# EAGLE design rpi2_lcd (EAGLE 7.6.0)
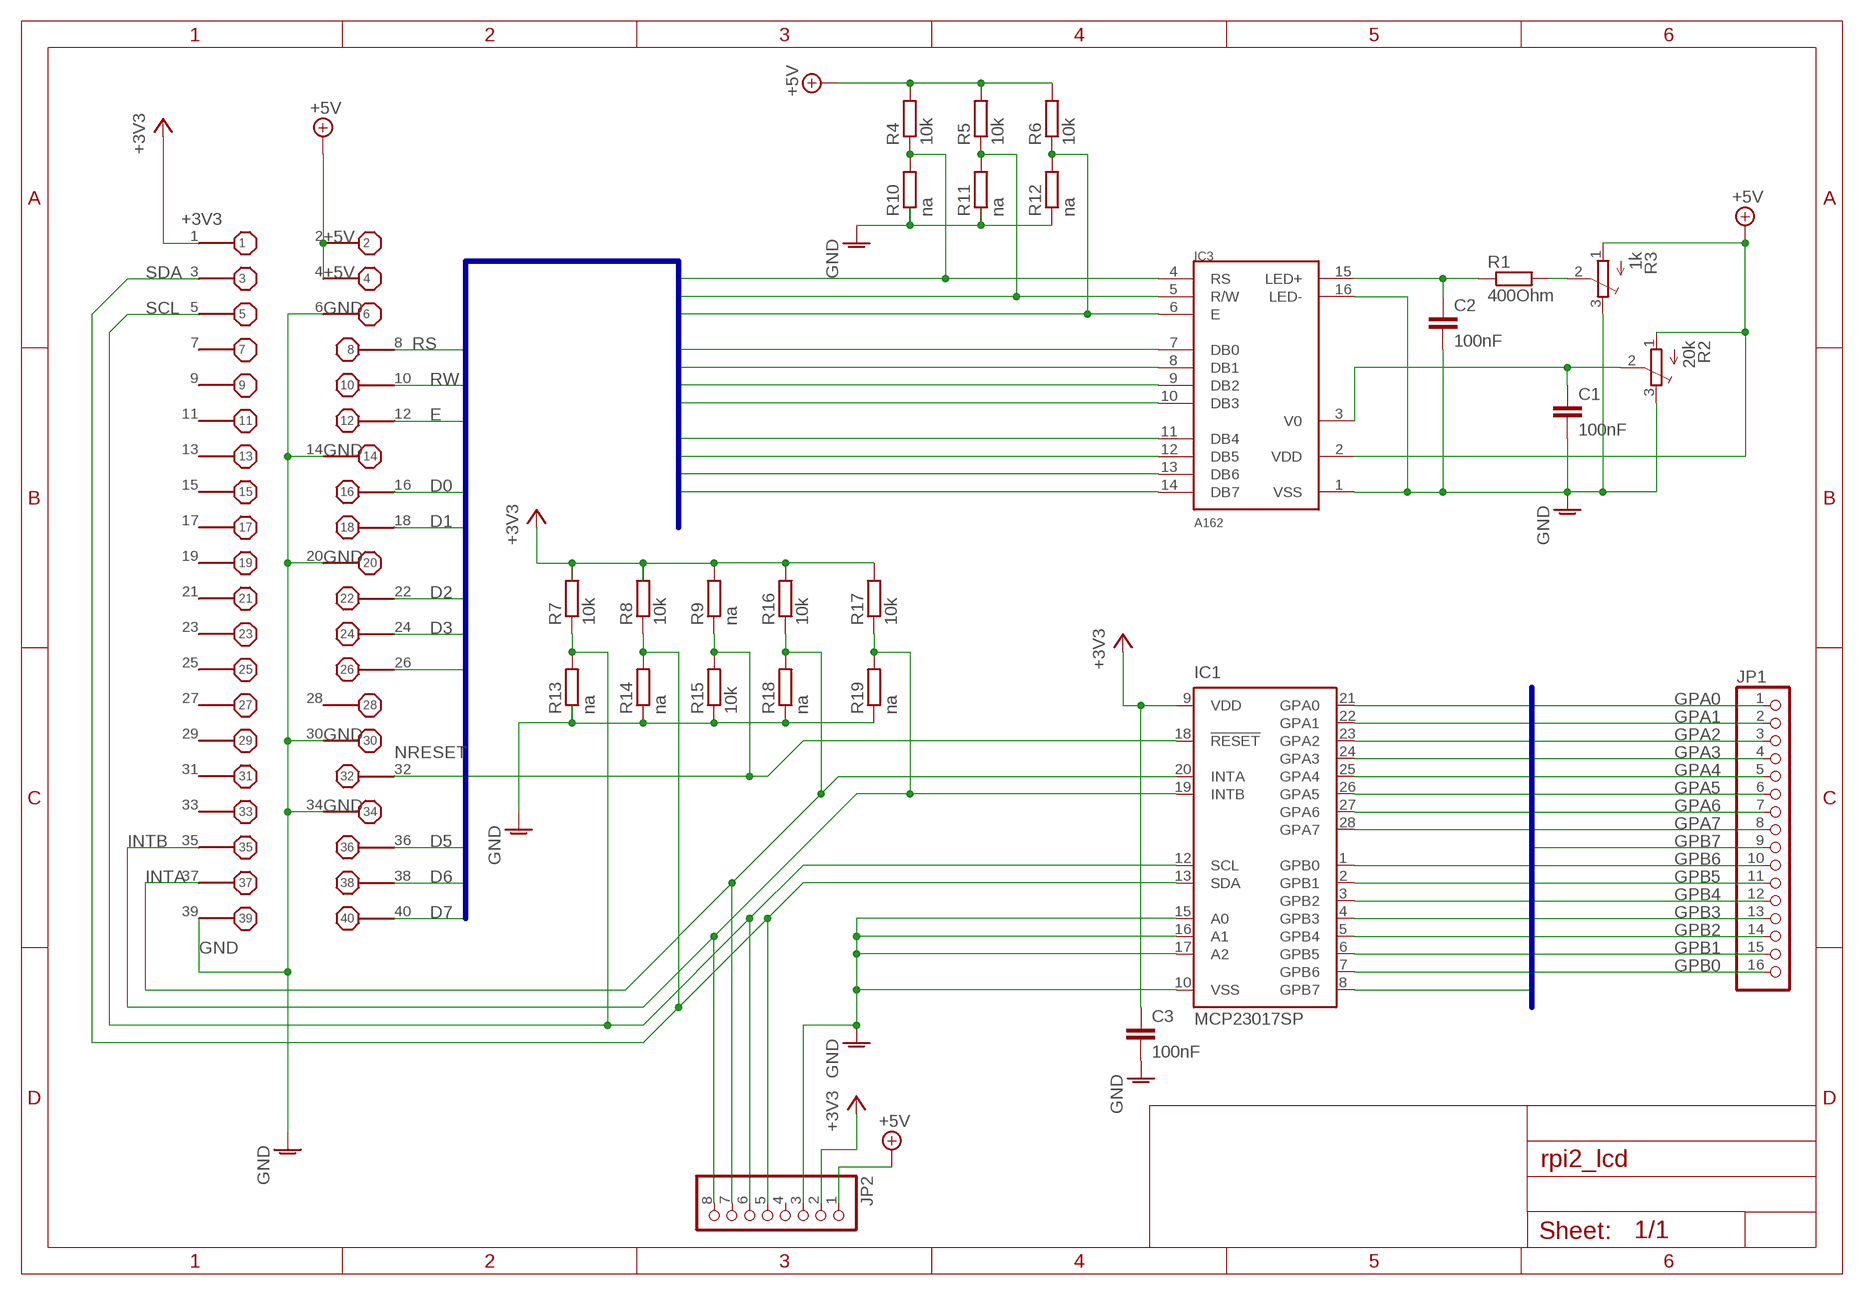
[diagram p0: schematic, sheet 1]

## Parts
C1  100nF  C-EUC0603  [C0603]
C2  100nF  C-EUC0603  [C0603]
C3  100nF  C-EUC0603  [C0603]
IC1  MCP23017SP  [DIL28-3]
IC3  A162  [A162]
JP1  PINHD-1X16  [1X16]
JP2  PINHD-1X8  [1X08]
R1  400Ohm  R-EU_R0603  [R0603]
R2  20k  TRIM_EU-SM-42/43W  [SM-42/43W]
R3  1k  TRIM_EU-SM-42/43W  [SM-42/43W]
R4  10k  R-EU_R0603  [R0603]
R5  10k  R-EU_R0603  [R0603]
R6  10k  R-EU_R0603  [R0603]
R7  10k  R-EU_R0603  [R0603]
R8  10k  R-EU_R0603  [R0603]
R9  na  R-EU_R0603  [R0603]
R10  na  R-EU_R0603  [R0603]
R11  na  R-EU_R0603  [R0603]
R12  na  R-EU_R0603  [R0603]
R13  na  R-EU_R0603  [R0603]
R14  na  R-EU_R0603  [R0603]
R15  10k  R-EU_R0603  [R0603]
R16  10k  R-EU_R0603  [R0603]
R17  10k  R-EU_R0603  [R0603]
R18  na  R-EU_R0603  [R0603]
R19  na  R-EU_R0603  [R0603]
X1  B+_GPIO  [B+_GPIO]

## Nets
+3V3: C3.1 IC1.9(VDD) JP2.2 R7.2 R8.2 R9.2 R16.2 R17.2 X1.1
+5V: IC3.2(VDD) JP2.1 R2.1(A) R3.1(A) R4.2 R5.2 R6.2 X1.2 X1.4
D0: IC3.7(DB0) X1.16
D1: IC3.8(DB1) X1.18
D2: IC3.9(DB2) X1.22
D3: IC3.10(DB3) X1.24
D4: IC3.11(DB4) X1.26
D5: IC3.12(DB5) X1.36
D6: IC3.13(DB6) X1.38
D7: IC3.14(DB7) X1.40
E: IC3.6(E) R6.1 R12.2 X1.12
GND: C1.2 C2.2 C3.2 IC1.10(VSS) IC1.15(A0) IC1.16(A1) IC1.17(A2) IC3.1(VSS) IC3.16(LED-) JP2.3 R2.3(E) R3.3(E) R10.1 R11.1 R12.1 R13.1 R14.1 R15.1 R18.1 R19.1 X1.6 X1.14 X1.20 X1.30 X1.34 X1.39
GPA0: IC1.21(GPA0) JP1.1
GPA1: IC1.22(GPA1) JP1.2
GPA2: IC1.23(GPA2) JP1.3
GPA3: IC1.24(GPA3) JP1.4
GPA4: IC1.25(GPA4) JP1.5
GPA5: IC1.26(GPA5) JP1.6
GPA6: IC1.27(GPA6) JP1.7
GPA7: IC1.28(GPA7) JP1.8
GPB0: IC1.1(GPB0) JP1.16
GPB1: IC1.2(GPB1) JP1.15
GPB2: IC1.3(GPB2) JP1.14
GPB3: IC1.4(GPB3) JP1.13
GPB4: IC1.5(GPB4) JP1.12
GPB5: IC1.6(GPB5) JP1.11
GPB6: IC1.7(GPB6) JP1.10
GPB7: IC1.8(GPB7) JP1.9
INTA: IC1.20(INTA) JP2.7 R16.1 R18.2 X1.37
INTB: IC1.19(INTB) JP2.8 R17.1 R19.2 X1.35
N$1: C2.1 IC3.15(LED+) R1.1
N$2: C1.1 IC3.3(V0) R2.2(S)
N$8: R1.2 R3.2(S)
NRESET: IC1.18(!RESET) R9.1 R15.2 X1.32
RS: IC3.4(RS) R4.1 R10.2 X1.8
RW: IC3.5(R/W) R5.1 R11.2 X1.10
SCL: IC1.12(SCL) JP2.6 R7.1 R13.2 X1.5
SDA: IC1.13(SDA) JP2.5 R8.1 R14.2 X1.3
Unconnected: JP2.4 X1.7 X1.9 X1.11 X1.13 X1.15 X1.17 X1.19 X1.21 X1.23 X1.25 X1.27 X1.28 X1.29 X1.31 X1.33

## Buses
GPA[0..7],GPB[0..7]
RS,RW,E,D[0..7]

## Library data of the parts
C1-C3 = rcl:C-EU: CAPACITOR, European symbol
IC1 = microchip:MCP23017: http://ww1.microchip.com/downloads/en/DeviceDoc/21952a.pdf Source: http://ww1.microchip.com/downloads/en/DeviceDoc/21952a.pdf; MF: MICROCHIP; MPN: MCP23017-E/SP; OC_FARNELL: 1332088; OC_NEWARK: 31K2959
IC3 = display:A162
JP1 = pinhead:PINHD-1X16: PIN HEADER
JP2 = pinhead:PINHD-1X8: PIN HEADER
R1 R4-R19 = rcl:R-EU_: RESISTOR, European symbol
R2 R3 = pot:TRIM_EU-: POTENTIOMETER
X1 = raspberry:B+_GPIO

## Board
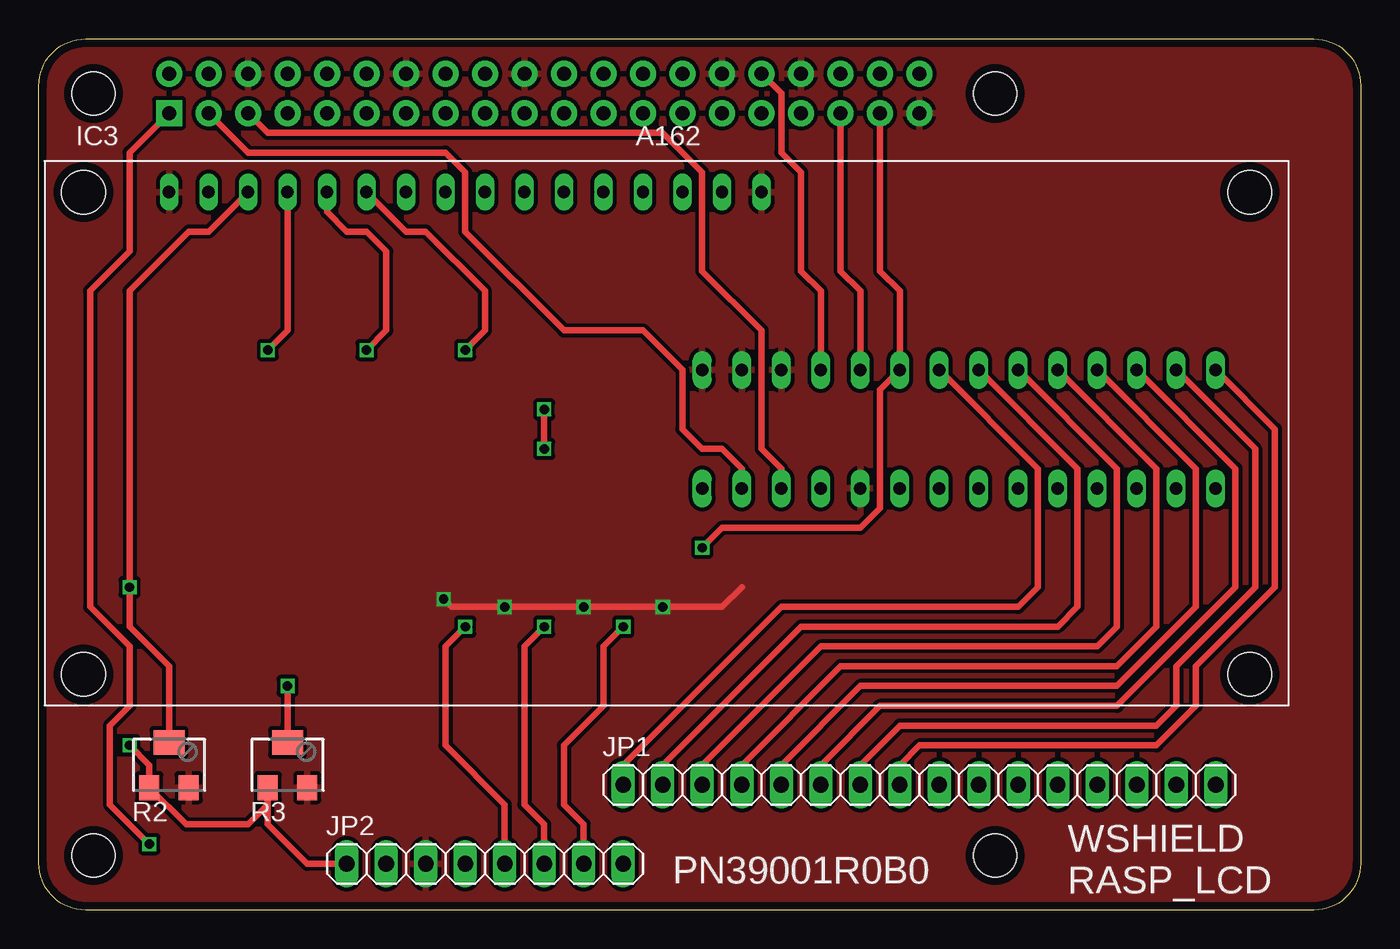
[diagram p1: board, top side]
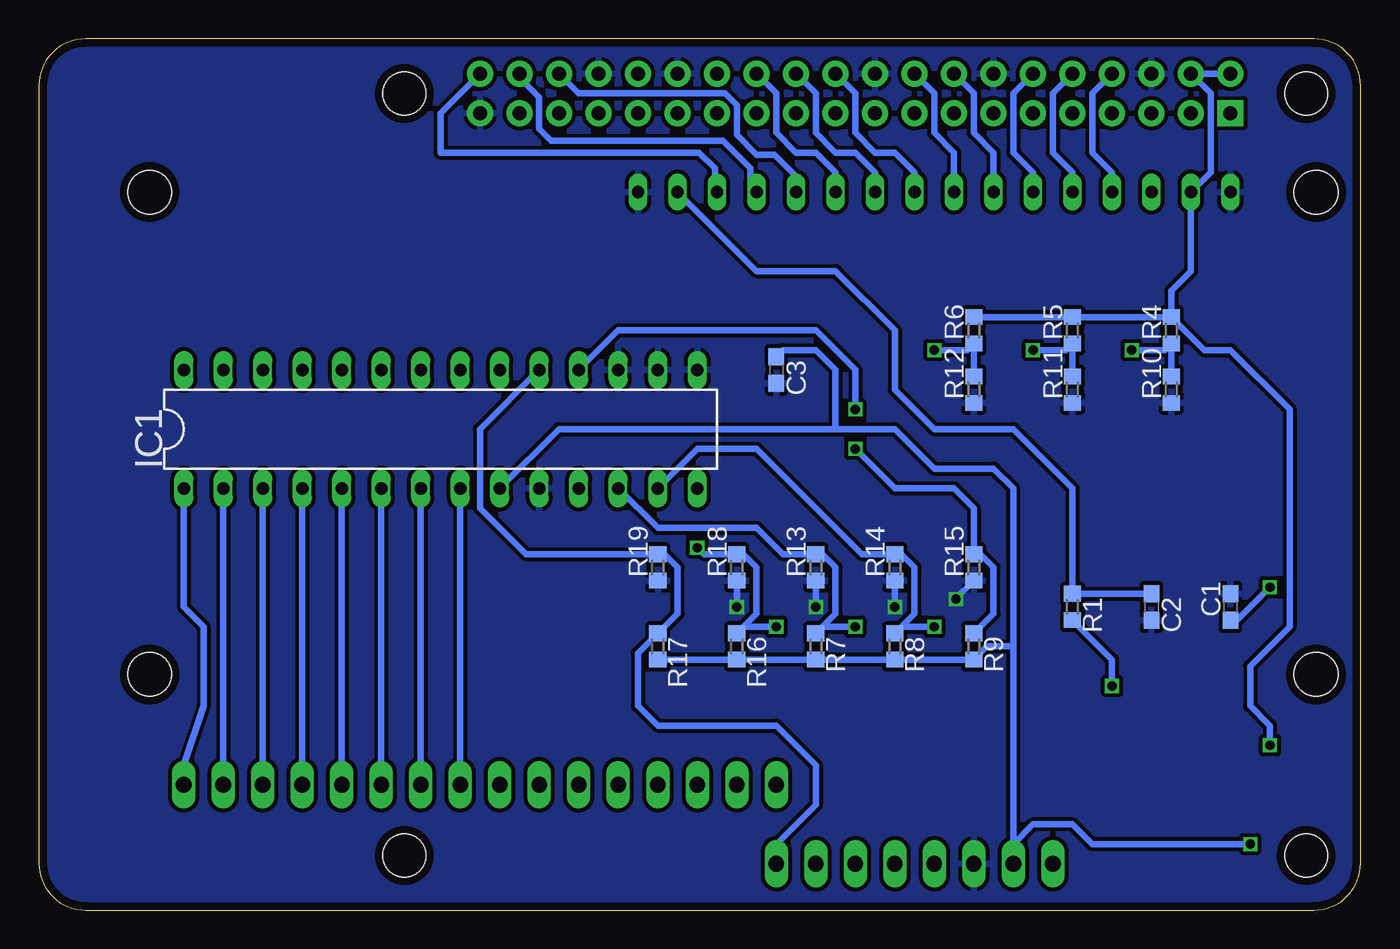
[diagram p2: board, bottom side, seen from below]

Size 85 x 56 mm. Coordinates in mm from the lower left corner, seen from the top.
Outline: 0,53 arc-90 3,56 82,56 arc-90 85,53 85,3 arc-90 82,0 3,0 arc-90 0,3 0,53
Copper layers (1*16): Top 0.035mm / dielectric 1.6mm / Bottom 0.035mm
Design rules "Elecrow_2-layer_PCB_eagle_rule": minimum track width 6mil, minimum drill 12mil, track to track 6mil, track to pad 6mil, pad to pad 6mil, via to via 8mil, smd to smd 0mil, copper to edge 20mil, drill to drill 10mil, minimum pad ring 6mil, minimum via ring 6mil, stop-mask expansion 0mil, vias tented up to drill 100mil, thermal gap 10mil
Holes 2.75 mm at 3.5,52.5 3.5,3.5 61.5,52.5 61.5,3.5

### Footprints (pad centres in the part's own frame; a part is rotated, then mirrored left to right if it is on the bottom)
C0603 = smd 1.1 x 1: 1 -0.85,0; 2 0.85,0
DIL28-3 = drill 0.813 long: 1 -16.51,-3.81; 2 -13.97,-3.81; 3 -11.43,-3.81; 4 -8.89,-3.81; 5 -6.35,-3.81; 6 -3.81,-3.81; 7 -1.27,-3.81; 8 1.27,-3.81; 9 3.81,-3.81; 10 6.35,-3.81; 11 8.89,-3.81; 12 11.43,-3.81; 13 13.97,-3.81; 14 16.51,-3.81; 15 16.51,3.81; 16 13.97,3.81; 17 11.43,3.81; 18 8.89,3.81; 19 6.35,3.81; 20 3.81,3.81; 21 1.27,3.81; 22 -1.27,3.81; 23 -3.81,3.81; 24 -6.35,3.81; 25 -8.89,3.81; 26 -11.43,3.81; 27 -13.97,3.81; 28 -16.51,3.81
A162 = drill 0.8 long: 1 0,0; 2 2.54,0; 3 5.08,0; 4 7.62,0; 5 10.16,0; 6 12.7,0; 7 15.24,0; 8 17.78,0; 9 20.32,0; 10 22.86,0; 11 25.4,0; 12 27.94,0; 13 30.48,0; 14 33.02,0; 15 35.56,0; 16 38.1,0 | hole 2.8: -5.5,0; -5.5,-31; 69.5,0; 69.5,-31
1X16 = drill 1.016 long: 1 -19.05,0; 2 -16.51,0; 3 -13.97,0; 4 -11.43,0; 5 -8.89,0; 6 -6.35,0; 7 -3.81,0; 8 -1.27,0; 9 1.27,0; 10 3.81,0; 11 6.35,0; 12 8.89,0; 13 11.43,0; 14 13.97,0; 15 16.51,0; 16 19.05,0
1X08 = drill 1.016 long: 1 -8.89,0; 2 -6.35,0; 3 -3.81,0; 4 -1.27,0; 5 1.27,0; 6 3.81,0; 7 6.35,0; 8 8.89,0
R0603 = smd 1 x 1.1: 1 -0.85,0; 2 0.85,0
SM-42/43W = smd 1.3 x 1.6: 1 -1.27,-1.45; 3 1.27,-1.45 | smd 2 x 1.6: 2 0,1.45
B+_GPIO = drill 0.9 pad 1.676 square: 1 -24.13,-1.27 | drill 0.9 pad 1.676: 2 -24.13,1.27; 3 -21.59,-1.27; 4 -21.59,1.27; 5 -19.05,-1.27; 6 -19.05,1.27; 7 -16.51,-1.27; 8 -16.51,1.27; 9 -13.97,-1.27; 10 -13.97,1.27; 11 -11.43,-1.27; 12 -11.43,1.27; 13 -8.89,-1.27; 14 -8.89,1.27; 15 -6.35,-1.27; 16 -6.35,1.27; 17 -3.81,-1.27; 18 -3.81,1.27; 19 -1.27,-1.27; 20 -1.27,1.27; 21 1.27,-1.27; 22 1.27,1.27; 23 3.81,-1.27; 24 3.81,1.27; 25 6.35,-1.27; 26 6.35,1.27; 27 8.89,-1.27; 28 8.89,1.27; 29 11.43,-1.27; 30 11.43,1.27; 31 13.97,-1.27; 32 13.97,1.27; 33 16.51,-1.27; 34 16.51,1.27; 35 19.05,-1.27; 36 19.05,1.27; 37 21.59,-1.27; 38 21.59,1.27; 39 24.13,-1.27; 40 24.13,1.27

### Placement (x,y rotation side)
C1  8.37,19.48 90 bottom
C2  13.45,19.48 270 bottom
C3  37.58,34.72 270 bottom
IC1  59.17,30.91 0 bottom
IC3  8.37,46.15 0 top
JP1  56.63,8.05 0 top
JP2  28.69,2.97 0 top
R1  18.53,19.48 270 bottom
R2  8.37,9.32 0 top
R3  15.99,9.32 0 top
R4  12.18,37.26 90 bottom
R5  18.53,37.26 90 bottom
R6  24.88,37.26 90 bottom
R7  35.04,16.94 270 bottom
R8  29.96,16.94 270 bottom
R9  24.88,16.94 270 bottom
R10  12.18,33.45 90 bottom
R11  18.53,33.45 90 bottom
R12  24.88,33.45 90 bottom
R13  35.04,22.02 90 bottom
R14  29.96,22.02 90 bottom
R15  24.88,22.02 90 bottom
R16  40.12,16.94 270 bottom
R17  45.2,16.94 270 bottom
R18  40.12,22.02 90 bottom
R19  45.2,22.02 90 bottom
X1  32.5,52.5 0 top

### Tracks (layer width: path | path; a pad name or v marks a point on that pad's centre or on a via)
+3V3  (via drill 0.6)
  Top 0.406: X1.1 5.83,48.69 5.83,42.34 3.29,39.8 3.29,19.48 5.83,16.94 5.83,13.13 4.56,11.86 4.56,6.78 v7.1,4.24
  Bottom 0.406: IC1.9 51.55,30.91 33.77,30.91 | 22.34,16.94 JP2.2 22.34,4.24 21.07,5.51 18.53,5.51 17.26,4.24 v7.1,4.24 | 22.34,16.94 22.34,27.1 23.61,28.37 27.42,28.37 29.96,30.91 33.77,30.91 | C3.1 37.16,35.99 35.04,35.99 33.77,34.72 33.77,30.91 | 22.34,16.94 24.03,16.94 R9.2 R8.2 R7.2 R16.2 R17.2
+5V  (via drill 0.6)
  Top 0.406: JP2.1 17.26,2.97 14.72,5.51 R3.1 14.72,6.78 13.45,5.51 9.46,5.51 R2.1 7.1,9.32 v5.83,10.59
  Bottom 0.406: X1.2 X1.4 9.64,52.5 9.64,47.42 IC3.2 10.91,41.07 12.18,39.8 R4.2 | R4.2 R5.2 R6.2 | R4.2 10.06,35.99 8.37,35.99 4.56,32.18 4.56,18.21 7.1,15.67 7.1,13.13 5.83,11.86 v5.83,10.59
D0
  Bottom 0.406: X1.16 24.88,52.5 24.88,49.96 23.61,48.69 IC3.7
D1
  Bottom 0.406: X1.18 27.42,52.5 27.42,49.96 26.15,48.69 IC3.8
D2
  Bottom 0.406: X1.22 32.5,52.5 32.5,49.96 31.23,48.69 29.96,48.69 28.69,47.42 IC3.9
D3
  Bottom 0.406: X1.24 35.04,52.5 35.04,49.96 33.77,48.69 32.5,48.69 31.23,47.42 IC3.10
D4
  Bottom 0.406: X1.26 37.58,52.5 37.58,49.96 36.31,48.69 35.04,48.69 33.77,47.42 IC3.11
D5
  Bottom 0.406: X1.36 50.28,52.5 40.88,52.5 40.12,51.74 40.12,49.83 38.85,48.56 37.71,48.56 36.06,46.91 36.06,46.4 IC3.12
D6
  Bottom 0.406: X1.38 54.09,53.52 52.82,52.25 52.82,50.21 52.06,49.45 41.01,49.45 39.23,47.67 39.23,46.53 IC3.13
D7
  Bottom 0.406: IC3.14 41.52,46.28 41.52,47.67 42.53,48.69 59.17,48.69 59.17,51.23 X1.40 56.63,53.64
E  (via drill 0.6)
  Top 0.406: v27.42,35.99 28.69,37.26 28.69,39.8 24.88,43.61 23.61,43.61 IC3.6
  Bottom 0.406: X1.12 22.34,52.5 22.34,48.69 21.07,47.42 IC3.6 | R12.2 R6.1 25.3,35.99 v27.42,35.99
GND  (via drill 0.6)
  Top 0.406: v26.02,19.99 26.53,19.48 v29.96,19.48 v35.04,19.48 v40.12,19.48 43.93,19.48 45.2,20.75
  Bottom 0.406: R15.1 26.02,20.03 v26.02,19.99 | R14.1 v29.96,19.48 | R13.1 v35.04,19.48 | R18.1 v40.12,19.48
  pour Top (isolate 0.254): 0.11,53.13 arc-90 2.66,55.67 3.92,55.67 82.03,55.67 arc-90 84.57,53.13 84.57,52.5 84.57,2.97 arc-90 82.03,0.43 81.39,0.43 80.76,0.43 40.12,0.43 3.92,0.43 arc-90 0.11,4.24
  pour Bottom (isolate 0.254): 0.11,52.5 arc-90 3.29,55.67 3.92,55.67 82.03,55.67 arc-90 84.57,53.13 84.57,52.5 84.57,2.97 arc-90 82.03,0.43 81.39,0.43 2.66,0.43 arc-90 0.11,2.97 0.11,3.6
GPA0
  Top 0.406: IC1.21 64.25,28.37 64.25,20.75 62.98,19.48 47.74,19.48 37.58,9.32 JP1.1
GPA1
  Top 0.406: IC1.22 66.79,28.37 66.79,19.48 65.52,18.21 49.01,18.21 40.12,9.32 JP1.2
GPA2
  Top 0.406: IC1.23 69.33,28.37 69.33,18.21 68.06,16.94 50.28,16.94 42.66,9.32 JP1.3
GPA3
  Top 0.406: IC1.24 71.87,28.37 71.87,18.21 69.33,15.67 51.55,15.67 45.2,9.32 JP1.4
GPA4
  Top 0.406: IC1.25 74.41,28.37 74.41,19.48 69.33,14.4 52.82,14.4 47.74,9.32 JP1.5
GPA5
  Top 0.406: IC1.26 76.95,28.37 76.95,20.75 69.33,13.13 54.09,13.13 50.28,9.32 JP1.6
GPA6
  Top 0.406: IC1.27 78.22,29.64 78.22,20.75 73.14,15.67 73.14,13.13 71.87,11.86 55.36,11.86 52.82,9.32 JP1.7
GPA7
  Top 0.406: IC1.28 79.49,30.91 79.49,20.75 74.41,15.67 74.41,13.13 71.87,10.59 56.63,10.59 55.36,9.32 JP1.8
GPB0
  Bottom 0.406: IC1.1 75.68,19.48 74.41,18.21 74.41,13.13 75.68,9.32 JP1.16
GPB1
  Bottom 0.406: 73.14,9.32 JP1.15 IC1.2
GPB2
  Bottom 0.406: IC1.3 JP1.14
GPB3
  Bottom 0.406: IC1.4 JP1.13
GPB4
  Bottom 0.406: IC1.5 JP1.12
GPB5
  Bottom 0.406: IC1.6 JP1.11
GPB6
  Bottom 0.406: IC1.7 JP1.10
GPB7
  Bottom 0.406: IC1.8 JP1.9
INTA  (via drill 0.6)
  Top 0.406: X1.37 54.09,41.07 55.36,39.8 IC1.20 54.09,33.45 54.09,25.83 52.82,24.56 43.93,24.56 v42.66,23.29 | v37.58,18.21 36.31,16.94 36.31,13.13 33.77,10.59 33.77,6.78 35.04,5.51 JP2.7
  Bottom 0.406: R16.1 39.7,18.21 | 39.7,18.21 v37.58,18.21 | v42.66,23.29 42.24,22.87 R18.2 39.7,22.87 38.85,22.02 38.85,19.06 39.7,18.21
INTB
  Top 0.406: X1.35 51.55,41.07 52.82,39.8 IC1.19
  Bottom 0.406: JP2.8 37.58,4.24 35.04,6.78 35.04,9.32 37.58,11.86 45.2,11.86 46.47,13.13 46.47,16.52 R17.1 43.93,19.06 43.93,22.02 44.78,22.87 R19.2 53.67,22.87 56.63,25.83 56.63,30.91 IC1.19
N$1
  Bottom 0.406: C2.1 R1.1 18.53,27.1 22.34,30.91 27.42,30.91 29.96,33.45 29.96,37.26 33.77,41.07 38.85,41.07 IC3.15
N$2  (via drill 0.6)
  Top 0.406: IC3.3 10.91,43.61 9.64,43.61 5.83,39.8 v5.83,20.75 5.83,18.21 8.37,15.67 R2.2
  Bottom 0.406: v5.83,20.75 7.95,18.63 C1.1
N$8  (via drill 0.6)
  Top 0.406: 15.99,11.86 R3.2 v15.99,14.4
  Bottom 0.406: R1.2 15.99,16.09 v15.99,14.4
NRESET  (via drill 0.6)
  Top 0.406: X1.32 47.74,52.5 47.74,48.69 49.01,47.42 49.01,41.07 50.28,39.8 IC1.18 | v32.5,32.18 v32.5,29.64
  Bottom 0.406: IC1.18 47.74,37.26 35.04,37.26 32.5,34.72 v32.5,32.18 | v32.5,29.64 29.96,27.1 26.15,27.1 24.88,25.83 R15.2 24.46,22.87 23.61,22.02 23.61,19.06 R9.1
RS  (via drill 0.6)
  Top 0.406: v14.72,35.99 15.99,37.26 IC3.4
  Bottom 0.406: X1.8 17.26,52.5 17.26,48.69 15.99,47.42 IC3.4 | R10.2 R4.1 12.6,35.99 v14.72,35.99
RW  (via drill 0.6)
  Top 0.406: v21.07,35.99 22.34,37.26 22.34,42.34 21.07,43.61 19.8,43.61 18.53,44.88 IC3.5
  Bottom 0.406: X1.10 19.8,52.5 19.8,48.69 18.53,47.42 IC3.5 | R11.2 R5.1 18.95,35.99 v21.07,35.99
SCL  (via drill 0.6)
  Top 0.406: v32.5,18.21 31.23,16.94 31.23,6.78 32.5,5.51 JP2.6 | X1.5 14.72,49.96 40.12,49.96 42.66,47.42 42.66,41.07 46.47,37.26 46.47,29.64 47.74,28.37 IC1.12
  Bottom 0.406: R7.1 34.62,18.21 | 34.62,18.21 v32.5,18.21 | IC1.12 45.2,24.56 38.85,24.56 37.16,22.87 R13.2 34.62,22.87 33.77,22.02 33.77,19.06 34.62,18.21
SDA  (via drill 0.6)
  Top 0.406: v27.42,18.21 26.15,16.94 26.15,10.59 29.96,6.78 JP2.5 | X1.3 13.45,48.69 26.15,48.69 27.42,47.42 27.42,43.61 33.77,37.26 38.85,37.26 41.39,34.72 41.39,30.91 42.66,29.64 43.93,29.64 45.2,28.37 IC1.13
  Bottom 0.406: R8.1 29.54,18.21 | 29.54,18.21 v27.42,18.21 | IC1.13 42.66,29.64 38.85,29.64 32.08,22.87 R14.2 29.54,22.87 28.69,22.02 28.69,19.06 29.54,18.21

### Text on the board
tNames: PN39001R0B0 | WSHIELD / RASP_LCD